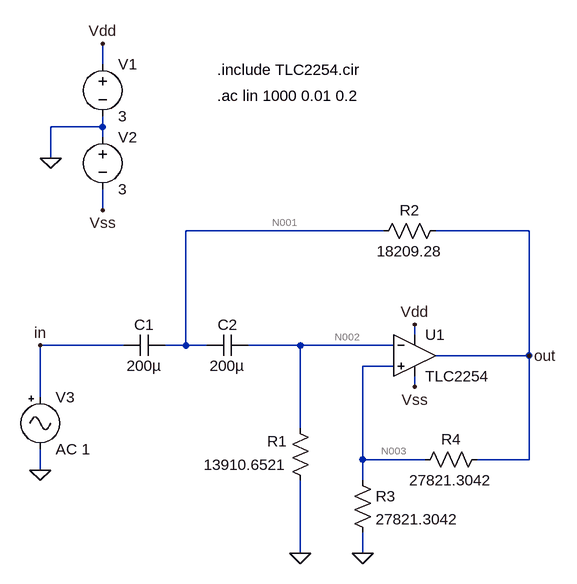
[diagram p0: schematic passa_altas_vcvs_2_ordem.asc]
passa_altas_vcvs_2_ordem.asc, the LTspice schematic file:
Version 4
SHEET 1 880 680
WIRE -272 -272 -272 -304
WIRE -272 -176 -272 -192
WIRE -272 -176 -352 -176
WIRE -272 -160 -272 -176
WIRE -352 -128 -352 -176
WIRE -272 -48 -272 -80
WIRE 160 -16 -144 -16
WIRE 384 -16 240 -16
WIRE 208 144 208 128
WIRE -240 160 -368 160
WIRE -144 160 -144 -16
WIRE -144 160 -176 160
WIRE -112 160 -144 160
WIRE 32 160 -48 160
WIRE 176 160 32 160
WIRE 384 176 384 -16
WIRE 384 176 240 176
WIRE 176 192 128 192
WIRE 208 224 208 208
WIRE -368 240 -368 160
WIRE 32 288 32 160
WIRE 128 336 128 192
WIRE 224 336 128 336
WIRE 384 336 384 176
WIRE 384 336 304 336
WIRE -368 352 -368 320
WIRE 128 368 128 336
WIRE 32 480 32 368
WIRE 128 480 128 448
FLAG 128 480 0
FLAG 32 480 0
FLAG -352 -128 0
FLAG -272 -304 Vdd
FLAG 208 128 Vdd
FLAG 208 224 Vss
FLAG -272 -48 Vss
FLAG -368 352 0
FLAG 384 176 out
FLAG -368 160 in
SYMBOL Opamps\\TLC2254 208 112 R0
SYMATTR InstName U1
SYMATTR SpiceModel TLC2254
SYMBOL res 48 384 R180
WINDOW 0 36 76 Left 2
WINDOW 3 36 40 Left 2
SYMATTR InstName R1
SYMATTR Value 13910.6521
SYMBOL res 144 0 R270
WINDOW 0 32 56 VTop 2
WINDOW 3 0 56 VBottom 2
SYMATTR InstName R2
SYMATTR Value 18209.28
SYMBOL res 112 352 R0
SYMATTR InstName R3
SYMATTR Value 27821.3042
SYMBOL res 320 320 R90
WINDOW 0 0 56 VBottom 2
WINDOW 3 32 56 VTop 2
SYMATTR InstName R4
SYMATTR Value 27821.3042
SYMBOL cap -176 144 R90
WINDOW 0 0 32 VBottom 2
WINDOW 3 32 32 VTop 2
SYMATTR InstName C1
SYMATTR Value 200µ
SYMBOL cap -48 144 R90
WINDOW 0 0 32 VBottom 2
WINDOW 3 32 32 VTop 2
SYMATTR InstName C2
SYMATTR Value 200µ
SYMBOL voltage -272 -288 R0
SYMATTR InstName V1
SYMATTR Value 3
SYMBOL voltage -272 -176 R0
SYMATTR InstName V2
SYMATTR Value 3
SYMBOL Misc\\signal -368 224 R0
WINDOW 123 0 0 Left 2
WINDOW 39 0 0 Left 2
SYMATTR InstName V3
SYMATTR Value AC 1
TEXT -96 -224 Left 2 !.ac lin 1000 0.01 0.2
TEXT -96 -264 Left 2 !.include TLC2254.cir

The netlist it stands for:
* passa_altas_vcvs_2_ordem.asc
XU1 N003 N002 Vdd Vss out TLC2254 TLC2254  ; pins In+ In- V+ V- OUT
R1 0 N002 13910.6521
R2 N001 out 18209.28
R3 N003 0 27821.3042
R4 out N003 27821.3042
C1 N001 in 200µ
C2 N002 N001 200µ
V1 Vdd 0 3
V2 0 Vss 3
V3 in 0 AC 1
.ac lin 1000 0.01 0.2
.include TLC2254.cir
.backanno
.end

* Results of the author's LTspice run, read from the files saved beside the schematic
* Operating Point, zero values left out:
*   V(out) = 11.22 µV
*   V(vss) = -3 V
*   V(vdd) = 3 V
*   V(n003) = 5.61 µV
*   V(n001) = 11.22 µV
*   I(R4) = 201.8 pA
*   I(R3) = 201.7 pA
*   I(V2) = -87.1 µA
*   I(V1) = -87.1 µA
*   Ix(u1:3) = 87.1 µA
*   Ix(u1:4) = -87.1 µA
*   Ix(u1:5) = -201.8 pA
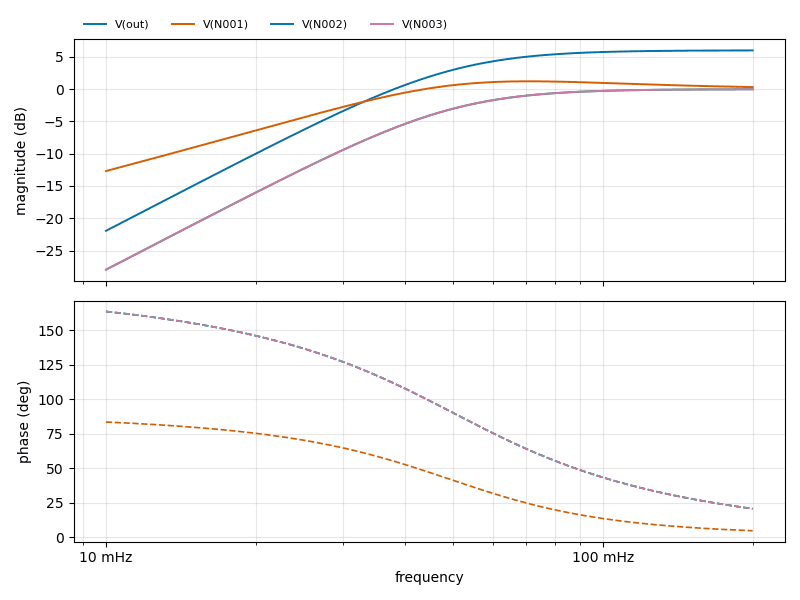
[diagram p1: AC Analysis of passa_altas_vcvs_2_ordem.asc, plotted from the saved traces]
* AC Analysis, 1 run:
*   V(out): -21.94 dB at 10 mHz, 6.00 dB at 200 mHz, peak 6.00 dB at 200 mHz, 3 dB below the peak at 49.9 mHz
*   V(N001): -12.69 dB at 10 mHz, 0.32 dB at 200 mHz, peak 1.22 dB at 71.05 mHz, 3 dB below the peak at 33.64 mHz
*   V(N002): -27.97 dB at 10 mHz, -0.02 dB at 200 mHz, peak -0.02 dB at 200 mHz, 3 dB below the peak at 49.9 mHz
*   V(N003): -27.96 dB at 10 mHz, -0.02 dB at 200 mHz, peak -0.02 dB at 200 mHz, 3 dB below the peak at 49.9 mHz